# Altium schematic sheet SAM_E54_Xplained_Pro_EDBG.SchDoc: Embedded Debugger (EDBG)
size A3; Organization: ATMEL Norway; Address1: Vestre Rosten 79; Address2: N-7075 TILLER; Address3: NORWAY; DocumentNumber: A09-2748; Revision: 4; SheetNumber: 9; SheetTotal: 13; PageSetup: Record=PageOptions|CenterHorizontal=True|CenterVertical=True|PrintScale=0.73|XCorrection=1.00|YCorrection=1.00|PrintKind=1|BorderSize=5000000|LeftOffset=0|BottomOffset=0|Orientation=2|PaperLength=1000|PaperWidth=1000|Scale=100|PaperSource=7|PrintQuality=-4|MediaType=1|DitherType=10|PaperKind=A3 (297 x 420 mm)|PrintScaleMode=1
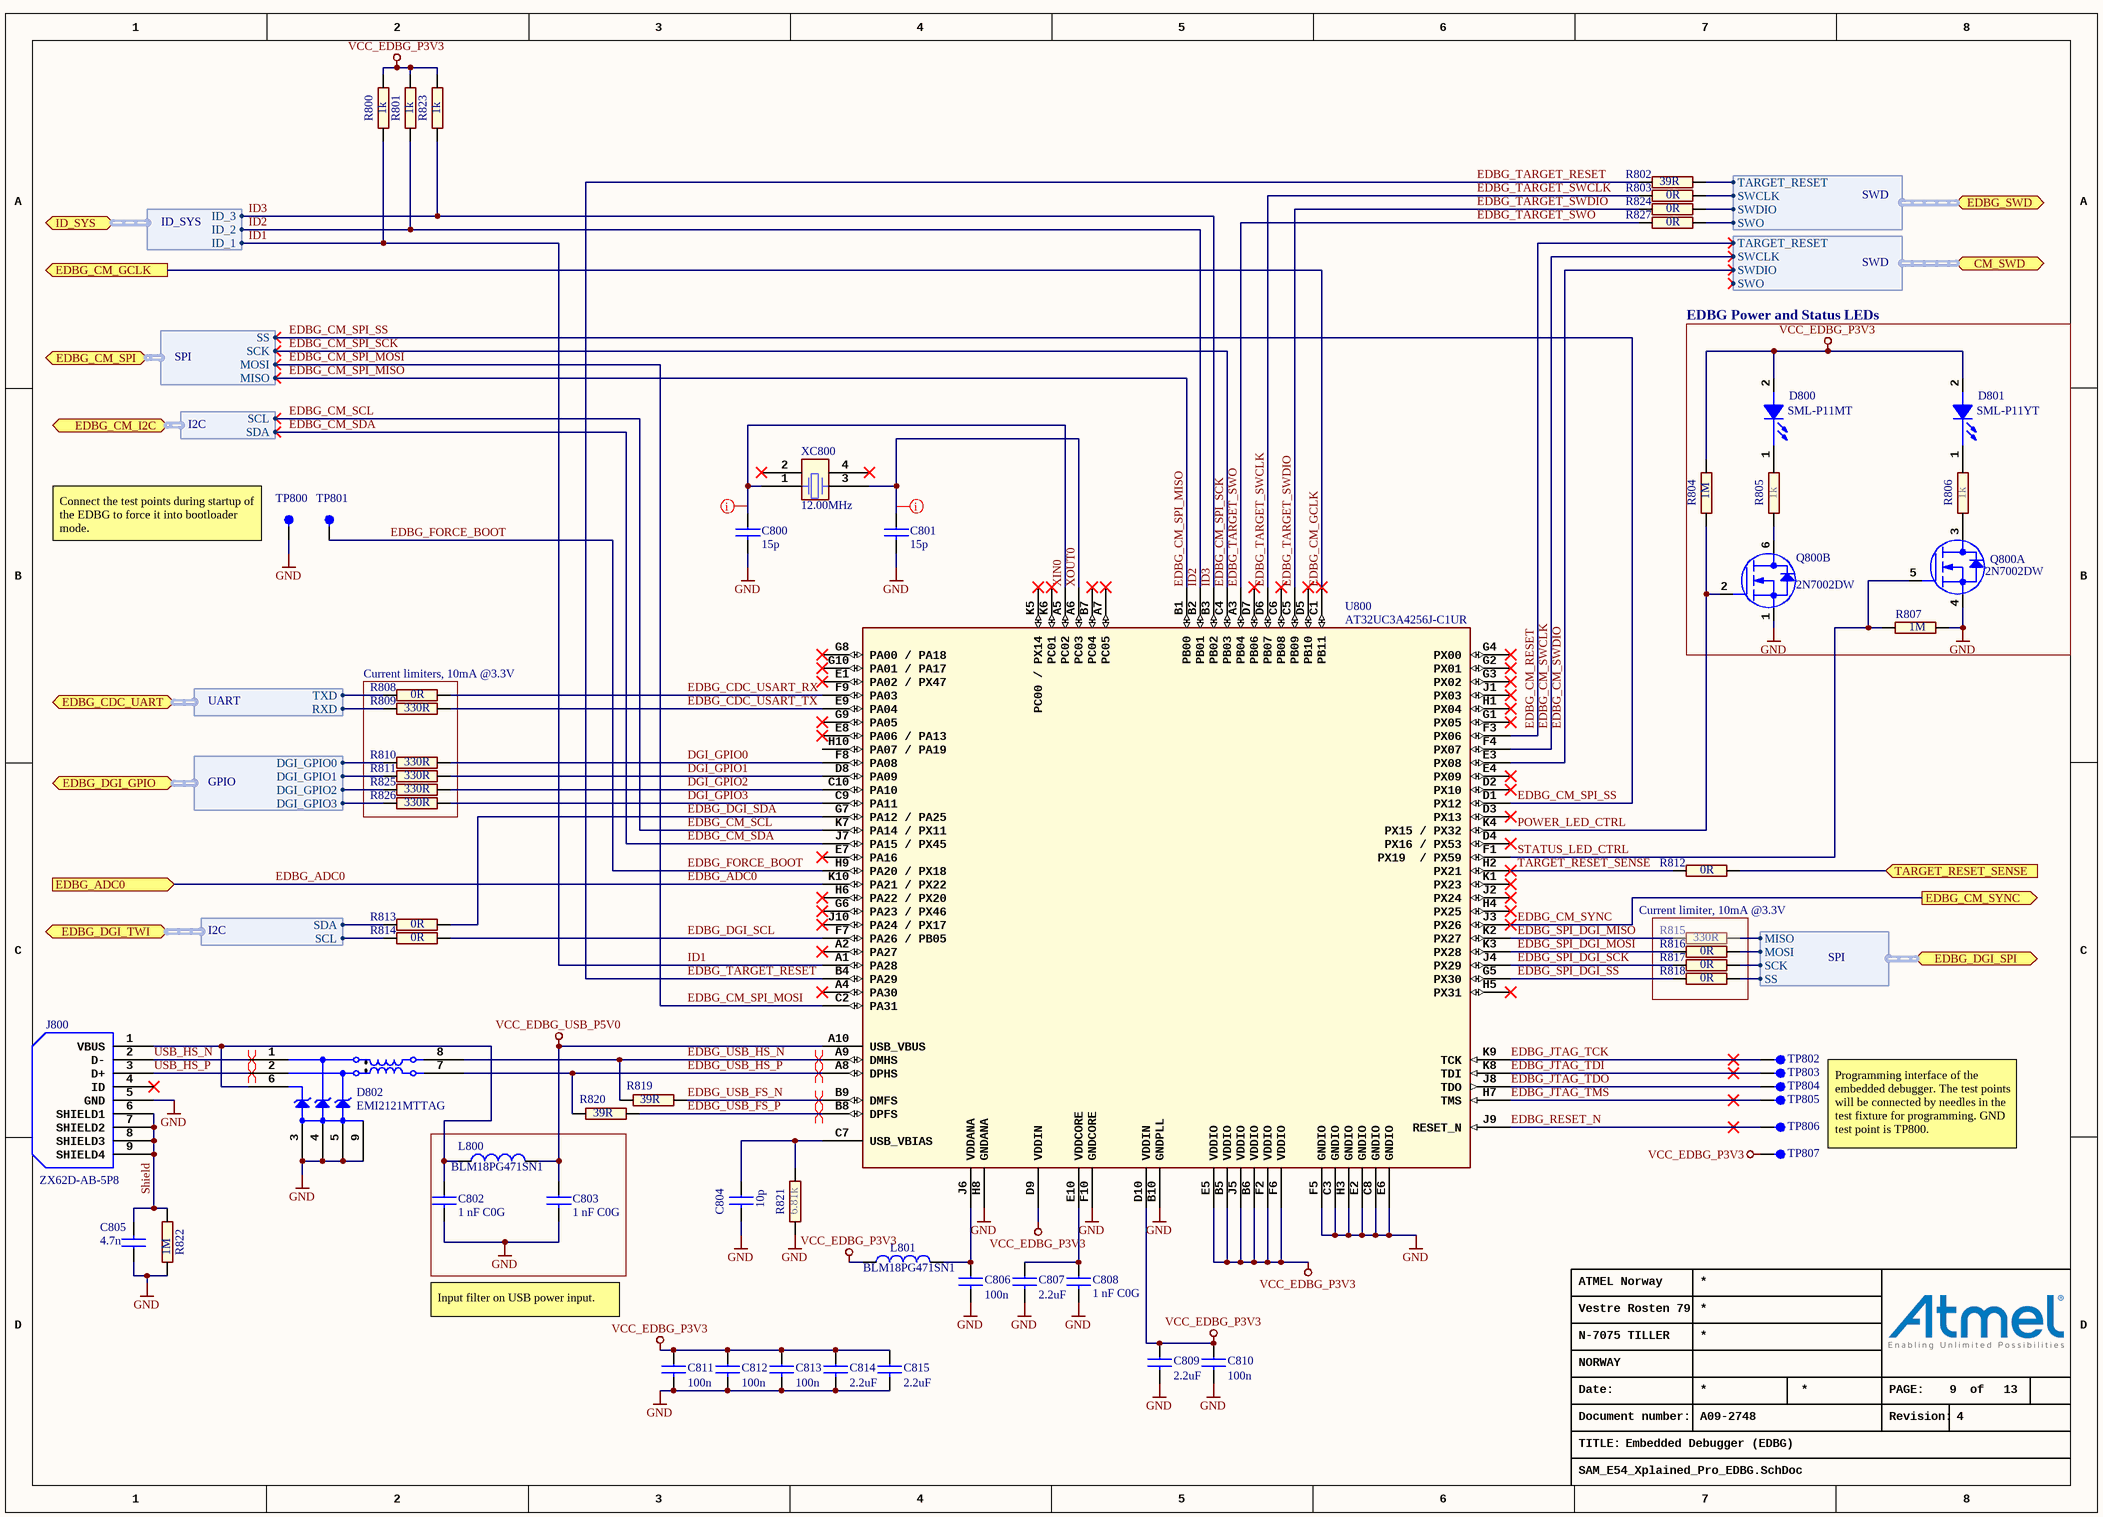
[diagram p0: SAM_E54_Xplained_Pro_EDBG.SchDoc]

## Parts
C800  value 15p  [AP1-00053]
C801  value 15p  [AP1-00053]
C802  value 1 nF C0G  [AP1-00053]
C803  value 1 nF C0G  [AP1-00053]
C804  value 10p  [AP1-00053]
C805  value 4.7n  [AP1-00053]
C806  value 100n  [AP1-00053]
C807  value 2.2uF  [AP1-00053]  (hidden comment: Farnell no: 1288200)
C808  value 1 nF C0G  [AP1-00053]
C809  value 2.2uF  [AP1-00053]  (hidden comment: Farnell no: 1288200)
C810  value 100n  [AP1-00053]
C811  value 100n  [AP1-00053]
C812  value 100n  [AP1-00053]
C813  value 100n  [AP1-00053]
C814  value 2.2uF  [AP1-00053]  (hidden comment: Farnell no: 1288200)
C815  value 2.2uF  [AP1-00053]  (hidden comment: Farnell no: 1288200)
D800  value SML-P11MT  [AP4-00160]
D801  value SML-P11YT  [AP4-00160]
D802  value EMI2121MTTAG  [AP4-00159]
J800  value ZX62D-AB-5P8  [AP8-00852]  (hidden comment: 2,000 pieces per reel)
L800  value BLM18PG471SN1  [AP3-00005]
L801  value BLM18PG471SN1  [AP3-00005]
Q800  value 2N7002DW  [AP5-00001]  (hidden comment: Same as 2N7002 but with two MOSFETs in one package)  (parts A,B of 2)
R800  value 1k  [AP2-00000]
R801  value 1k  [AP2-00000]
R802  value 39R  [AP2-00000]
R803  value 0R  [AP2-00000]
R804  value 1M  [AP2-00011]
R805  value 1k  [AP2-00011]
R806  value 1k  [AP2-00011]
R807  value 1M  [AP2-00011]
R808  value 0R  [AP2-00000]
R809  value 330R  [AP2-00000]
R810  value 330R  [AP2-00000]
R811  value 330R  [AP2-00000]
R812  value 0R  [AP2-00000]
R813  value 0R  [AP2-00000]
R814  value 0R  [AP2-00000]
R815  value 330R  [AP2-00000]
R816  value 0R  [AP2-00000]
R817  value 0R  [AP2-00000]
R818  value 0R  [AP2-00000]
R819  value 39R  [AP2-00011]
R820  value 39R  [AP2-00011]
R821  value 6.81k  [AP2-00011]
R822  value 1M  [AP2-00011]
R823  value 1k  [AP2-00000]
R824  value 0R  [AP2-00000]
R825  value 330R  [AP2-00000]
R826  value 330R  [AP2-00000]
R827  value 0R  [AP2-00000]
TP800  (no value)  [AP8-00010]  (no BOM)
TP801  (no value)  [AP8-00010]  (no BOM)
TP802  (no value)  [AP8-00010]  (no BOM)
TP803  (no value)  [AP8-00010]  (no BOM)
TP804  (no value)  [AP8-00010]  (no BOM)
TP805  (no value)  [AP8-00010]  (no BOM)
TP806  (no value)  [AP8-00010]  (no BOM)
TP807  (no value)  [AP8-00010]  (no BOM)
U800  value AT32UC3A4256J-C1UR  [AP6-00206]  (hidden comment: 100 ball VFBGA)
XC800  value 12.00MHz  [AP7-00089]

## Blocks framed on the sheet
EDBG Power and Status LEDs: D800 D801 Q800 R804-R807
Current limiters, 10mA @3.3V: R808-R811 R825 R826

## Ports
CM_SWD (harness SWD), EDBG_ADC0 (in), EDBG_CDC_UART (harness UART), EDBG_CM_GCLK (out), EDBG_CM_I2C (harness I2C), EDBG_CM_SPI (harness SPI), EDBG_CM_SYNC (out), EDBG_DGI_GPIO (harness GPIO), EDBG_DGI_SPI (harness SPI), EDBG_DGI_TWI (harness I2C), EDBG_SWD (harness SWD), ID_SYS (harness ID_SYS), TARGET_RESET_SENSE (in)

## Harnesses
UART: TXD, RXD
SPI: MISO, MOSI, SCK, SS
ID_SYS: ID_1, ID_3, ID_2
I2C: SCL, SDA
SWD: SWCLK, SWDIO, TARGET_RESET, SWO
GPIO: DGI_GPIO0, DGI_GPIO1, DGI_GPIO2, DGI_GPIO3

## Nets
GND: C800.2 C801.2 C802.2 C803.2 C804.2 C805.1 C806.2 C807.2 C808.2 C809.2 C810.2 C811.2 C812.2 C813.2 C814.2 C815.2 D802.3(GND) D802.4(GND) D802.5(GND) D802.9(GND) J800.5(GND) Q800.1(S2) Q800.4(S1) R807.1 R821.1 R822.1 TP800.1 U800.B10(GNDPLL) U800.C3(GNDIO) U800.C8(GNDIO) U800.E2(GNDIO) U800.E6(GNDIO) U800.F5(GNDIO) U800.F10(GNDCORE) U800.H3(GNDIO) U800.H8(GNDANA)
VCC_EDBG_P3V3: C809.1 C810.1 C811.1 C812.1 C813.1 C814.1 C815.1 D800.2(ANODE) D801.2(ANODE) L801.1 R800.2 R801.2 R804.2 R823.2 TP807.1 U800.B5(VDDIO) U800.B6(VDDIO) U800.D9(VDDIN) U800.D10(VDDIN) U800.E5(VDDIO) U800.F2(VDDIO) U800.F6(VDDIO) U800.J5(VDDIO)
VCC_EDBG_USB_P5V0: C803.1 L800.2 U800.A10(USB_VBUS)
DGI_GPIO0: R810.2 U800.F8(PA08)
DGI_GPIO1: R811.2 U800.D8(PA09)
DGI_GPIO2: R825.2 U800.C10(PA10)
DGI_GPIO3: R826.2 U800.C9(PA11)
EDBG_ADC0: U800.K10(PA21_/_PX22) ; port EDBG_ADC0
EDBG_CDC_USART_RX: R808.1 U800.F9(PA03)
EDBG_CDC_USART_TX: R809.2 U800.E9(PA04)
EDBG_CM_GCLK: U800.C1(PB11) ; port EDBG_CM_GCLK
EDBG_CM_RESET: U800.F3(PX06) ; port CM_SWD.TARGET_RESET
EDBG_CM_SCL: U800.K7(PA14_/_PX11) ; port EDBG_CM_I2C.SCL
EDBG_CM_SDA: U800.J7(PA15_/_PX45) ; port EDBG_CM_I2C.SDA
EDBG_CM_SPI_MISO: U800.B1(PB00) ; port EDBG_CM_SPI.MISO
EDBG_CM_SPI_MOSI: U800.C2(PA31) ; port EDBG_CM_SPI.MOSI
EDBG_CM_SPI_SCK: U800.C4(PB03) ; port EDBG_CM_SPI.SCK
EDBG_CM_SPI_SS: U800.D1(PX12) ; port EDBG_CM_SPI.SS
EDBG_CM_SWCLK: U800.F4(PX07) ; port CM_SWD.SWCLK
EDBG_CM_SWDIO: U800.E3(PX08) ; port CM_SWD.SWDIO
EDBG_CM_SYNC: U800.J3(PX26) ; port EDBG_CM_SYNC
EDBG_DGI_SCL: R814.1 U800.F7(PA26_/_PB05)
EDBG_DGI_SDA: R813.1 U800.G7(PA12_/_PA25)
EDBG_FORCE_BOOT: TP801.1 U800.H9(PA20_/_PX18)
EDBG_JTAG_TCK: TP802.1 U800.K9(TCK)
EDBG_JTAG_TDI: TP803.1 U800.K8(TDI)
EDBG_JTAG_TDO: TP804.1 U800.J8(TDO)
EDBG_JTAG_TMS: TP805.1 U800.H7(TMS)
EDBG_RESET_N: TP806.1 U800.J9(RESET_N)
EDBG_SPI_DGI_MISO: R815.1 U800.K2(PX27)
EDBG_SPI_DGI_MOSI: R816.2 U800.K3(PX28)
EDBG_SPI_DGI_SCK: R817.2 U800.J4(PX29)
EDBG_SPI_DGI_SS: R818.2 U800.G5(PX30)
EDBG_TARGET_RESET: R802.1 U800.B4(PA29)
EDBG_TARGET_SWCLK: R803.2 U800.D6(PB07)
EDBG_TARGET_SWDIO: R824.2 U800.C5(PB09)
EDBG_TARGET_SWO: R827.2 U800.A3(PB04)
EDBG_USB_FS_N: R819.2 U800.B9(DMFS)
EDBG_USB_FS_P: R820.2 U800.B8(DPFS)
EDBG_USB_HS_N: D802.8(DIFF1_INT) R819.1 U800.A9(DMHS)
EDBG_USB_HS_P: D802.7(DIFF2_INT) R820.1 U800.A8(DPHS)
ID1: R800.1 U800.A1(PA28) ; port ID_SYS.ID_1
ID2: R801.1 U800.B2(PB01) ; port ID_SYS.ID_2
ID3: R823.1 U800.B3(PB02) ; port ID_SYS.ID_3
POWER_LED_CTRL: Q800.2(G2) R804.1 U800.K4(PX15_/_PX32)
Shield: C805.2 J800.6(SHIELD1) J800.7(SHIELD2) J800.8(SHIELD3) J800.9(SHIELD4) R822.2
STATUS_LED_CTRL: Q800.5(G1) R807.2 U800.F1(PX19__/_PX59)
TARGET_RESET_SENSE: R812.2 U800.H2(PX21)
TARGET_RESET_SENSE: R812.1 ; port TARGET_RESET_SENSE  [a separate net that carries the same name]
USB_HS_N: D802.1(DIFF1_EXT) J800.2(D-)
USB_HS_P: D802.2(DIFF2_EXT) J800.3(D+)
XIN0: C800.1 U800.A5(PC02) XC800.1
XOUT0: C801.1 U800.A6(PC03) XC800.3
NetC802_1: C802.1 D802.6(VBUS) J800.1(VBUS) L800.1
NetC804_1: C804.1 R821.2 U800.C7(USB_VBIAS)
NetC806_1: C806.1 L801.2 U800.J6(VDDANA)
NetC807_1: C807.1 C808.1 U800.E10(VDDCORE)
NetD800_1: D800.1(CATHODE) R805.2
NetD801_1: D801.1(CATHODE) R806.2
NetQ800_3: Q800.3(D1) R806.1
NetQ800_6: Q800.6(D2) R805.1
NetR802_2: R802.2 ; port EDBG_SWD.TARGET_RESET
NetR803_1: R803.1 ; port EDBG_SWD.SWCLK
NetR808_2: R808.2 ; port EDBG_CDC_UART.TXD
NetR809_1: R809.1 ; port EDBG_CDC_UART.RXD
NetR810_1: R810.1 ; port EDBG_DGI_GPIO.DGI_GPIO0
NetR811_1: R811.1 ; port EDBG_DGI_GPIO.DGI_GPIO1
NetR813_2: R813.2 ; port EDBG_DGI_TWI.SDA
NetR814_2: R814.2 ; port EDBG_DGI_TWI.SCL
NetR815_2: R815.2 ; port EDBG_DGI_SPI.MISO
NetR816_1: R816.1 ; port EDBG_DGI_SPI.MOSI
NetR817_1: R817.1 ; port EDBG_DGI_SPI.SCK
NetR818_1: R818.1 ; port EDBG_DGI_SPI.SS
NetR824_1: R824.1 ; port EDBG_SWD.SWDIO
NetR825_1: R825.1 ; port EDBG_DGI_GPIO.DGI_GPIO2
NetR826_1: R826.1 ; port EDBG_DGI_GPIO.DGI_GPIO3
NetR827_1: R827.1 ; port EDBG_SWD.SWO

Not connected (* = marked no-connect by the designer): J800 4(ID)*; U800 A2(PA27)* A4(PA30)* A7(PC05)* B7(PC04)* C6(PB08)* D2(PX10)* D3(PX13)* D4(PX16_/_PX53)* D5(PB10)* D7(PB06)* E1(PA02_/_PX47)* E4(PX09)* E7(PA16)* E8(PA06_/_PA13)* G1(PX05)* G2(PX01)* G3(PX02)* G4(PX00)* G6(PA23_/_PX46)* G8(PA00_/_PA18)* G9(PA05)* G10(PA01_/_PA17)* H1(PX04)* H4(PX25)* H5(PX31)* H6(PA22_/_PX20)* H10(PA07_/_PA19) J1(PX03)* J2(PX24)* J10(PA24_/_PX17)* K1(PX23)* K5(PC00_/_PX14)* K6(PC01)*; XC800 2* 4*

## Layout directives
differential pair; rule Assembly Testpoint Usage [Testpoint - Not Allowed    Multiple - Not Allowed]: EDBG_USB_FS_N, EDBG_USB_FS_P, EDBG_USB_HS_N, EDBG_USB_HS_P, USB_HS_N, USB_HS_P
rule Assembly Testpoint Usage [Testpoint - Not Allowed    Multiple - Not Allowed]: XIN0, XOUT0

## Notes on the sheet
- (near TP800) Connect the test points during startup of the EDBG to force it into bootloader mode.
- Current limiter, 10mA @3.3V
- Programming interface of the embedded debugger. The test points will be connected by needles in the test fixture for programming. GND test point is TP800.
- Input filter on USB power input.
- Date:
- PAGE:
- of
- TITLE:
- Document number:
- Revision:

## Library data of the parts
C800 C801 = A01-0017: Ceramic capacitor, SMD 0402, NP0, 50V, +/-5%; PartGroup: Capacitors,Ceramic,SMD 0402; Manufacturer: AVX; MPN: 04025A150JAT2A; TemperatureRange: -55 - +125 deg C; AN: A01-0017; Height: 0,550000011920929; Tolerance: 50V, +/-5%
C802 C803 C808 = A01-0321: Ceramic capacitor, SMD 0402, C0G, 50V, +/-5%; PartGroup: Capacitors,Ceramic,SMD 0402; Manufacturer: Murata; MPN: GRM1555C1H102JA01D; Tolerance: 5%; AN: A01-0321; Height: 0,550000011920929
C804 = A01-0015: Ceramic capacitor, SMD 0402, NP0, 50V, +/-5%; PartGroup: Capacitors,Ceramic,SMD 0402; Manufacturer: AVX; MPN: 04025A100JAT2A; TemperatureRange: -55 - +125 deg C; AN: A01-0015; Tolerance: 50V, +/-5%; Height: 0,550000011920929
C805 = A01-0046: Ceramic capacitor, SMD 0402, X7R, 25V, +/-10%; PartGroup: Capacitors,Ceramic,SMD 0402; Manufacturer: PHYCOMP; MPN: 2238 587 15632; TemperatureRange: -55 - +125 deg C; AN: A01-0046; Tolerance: 25V, +/-10%; Height: 0,550000011920929
C806 C810-C813 = A01-0246: Ceramic capacitor, SMD 0402, X7R, 16V, +/-10%; PartGroup: Capacitors,Ceramic,SMD 0402; Manufacturer: Kemet; MPN: C0402C104K4RACTU; TemperatureRange: -55 - +125 deg C; AN: A01-0246; Tolerance: 16V, +/-10%; Height: 0,5
C807 C809 C814 C815 = A01-0300: Ceramic capacitor, SMD 0402, X5R, 6.3V, +/-20%; PartGroup: Capacitors,Ceramic,SMD 0402; Manufacturer: Kemet; MPN: C0402C225M9PAC; Tolerance: Â±20%; TemperatureRange: -55Â°C to +85Â°C; AN: A01-0300; Height: 0,5
D800 = A10-0183: LED, SMD 0402, Green, Wave length=569nm, 2.1mcd @ (1mA, 1.9Vf); PartGroup: Opto,LEDs,SMD; Manufacturer: ROHM; MPN: SML-P11MT-T86; TemperatureRange: -40 to +85; AN: A10-0183; Height: 0,200000002980232
D801 = A10-0182: LED, SMD 0402, Yellow, Wave length=586nm, 7.6mcd @ (1mA, 1.9Vf); PartGroup: Opto,LEDs,SMD; Manufacturer: ROHM; MPN: SML-P11YT-T86; TemperatureRange: -40 to +85; AN: A10-0182; Height: 0,200000002980232
D802 = A04-0195: EMI2121, SZEMI2121 Single Pair Common Mode Filter with ESD Protection; PartGroup: Diodes,Transient suppression; Manufacturer: ON Semiconductor; TemperatureRange: âˆ’40 to +85 Â°C; AN: A04-0195; Height: 0,800000011920929; MPN: EMI2121MTTAG
J800 = A08-2112: Micro USB AB Connector, Standard SMT + DIP; PartGroup: Mechanical devices,Connectors,USB; Manufacturer: HIROSE; MPN: ZX62D-AB-5P8(30); AN: A08-2112; Height: 2,79999995231628
L800 L801 = A03-0035: SMD RF inductor 0603. Z=470Ohm (@100MHz), Max R(dc)=0.65Ohm, Max current=1A; PartGroup: Inductors,EMI; Manufacturer: Murata; TemperatureRange: -55; AN: A03-0035; Height: 0,800000011920929; MPN: BLM18PG471SN1
Q800 = A05-0051: Dual N-Channel MOSFET, 60V, 115mA cont,RDS(ON) < 7.5 Ohm @50mA@5V, SOT-363; PartGroup: Transistors,Small signal FET,SMD; Manufacturer: Fairchild; TemperatureRange: -65 to 150 deg C; AN: A05-0051; Height: 1,10000002384186; MPN: 2N7002DW
R800 R801 R805 R806 R823 = A02-0212: Thick film resistor, SMD 0402, 1/16W, 1%; PartGroup: Resistors,SMD,0402 1%; Manufacturer: ASJ; MPN: CR10-1001-FK; TemperatureRange: -55 - +125 deg C; AN: A02-0212; Tolerance: 1 %; Height: 0,349999994039536
R802 R819 R820 = A02-0178: Thick film resistor, SMD 0402, 1/16W, 1%; PartGroup: Resistors,SMD,0402 1%; Manufacturer: ASJ; MPN: CR10-39R0-FK; TemperatureRange: -55 - +125 deg C; AN: A02-0178; Tolerance: 1 %; Height: 0,349999994039536
R803 R808 R812-R814 R816-R818 R824 R827 = A02-0163: RES 0.0 OHM 1/16W 0402 SMD; PartGroup: Resistors,SMD,0402 1%; Manufacturer: (n/a); MPN: RMCF0402ZT0R00; Tolerance: 1 %; TemperatureRange: -55 - +125 deg C; AN: A02-0163; Height: 0,349999994039536
R804 R807 R822 = A02-0284: Thick film resistor, SMD 0402, 1/16W, 1%; PartGroup: Resistors,SMD,0402 1%; Manufacturer: ASJ; MPN: CR10-1004-FK; TemperatureRange: -55 - +125 deg C; AN: A02-0284; Tolerance: 1 %; Height: 0,349999994039536
R809-R811 R815 R825 R826 = A02-0200: Thick film resistor, SMD 0402, 1/16W, 1%; PartGroup: Resistors,SMD,0402 1%; Manufacturer: ASJ; MPN: CR10-3300-FK; TemperatureRange: -55 - +125 deg C; AN: A02-0200; Tolerance: 1 %; Height: 0,349999994039536
R821 = A02-0539: Thick film resistor, SMD 0402, 1/16W, 1%; PartGroup: Resistors,SMD,0402 1%; Manufacturer: vishay; MPN: CRCW04026K81FKED; TemperatureRange: -55 - +125 deg C; AN: A02-0539; Tolerance: 1%; Height: 0,349999994039536
TP800-TP807 = A08-0004: Single SMD testpad; PartGroup: Mechanical devices,Connectors,Test points; AN: A08-0004; Value: TESTPAD; Height: 0
U800 = A06-0736: AVR 32-bit RISC MCU; PartGroup: Integrated Circuits,MCU, MPU, DSP,AVR MCU; Manufacturer: ATMEL; TemperatureRange: -40 to +85 deg C; AN: A06-0736; Height: 1; MPN: AT32UC3A4256J-C1UR
XC800 = A07-0128: Kyocera CX3225GB12000H0KPSC1, 12MHz, 12pF, SMD crystal; PartGroup: Frequency devices,Crystals,SMD; Manufacturer: Kyocera Crystal Device Corporation; Tolerance: Â±30ppm; TemperatureRange: -40Â°C to +85Â°C; AN: A07-0128; Height: 0,800000011920929; MPN: CX3225GB12000H0KPSC1